# Altium project VolksEEG.PrjPcb
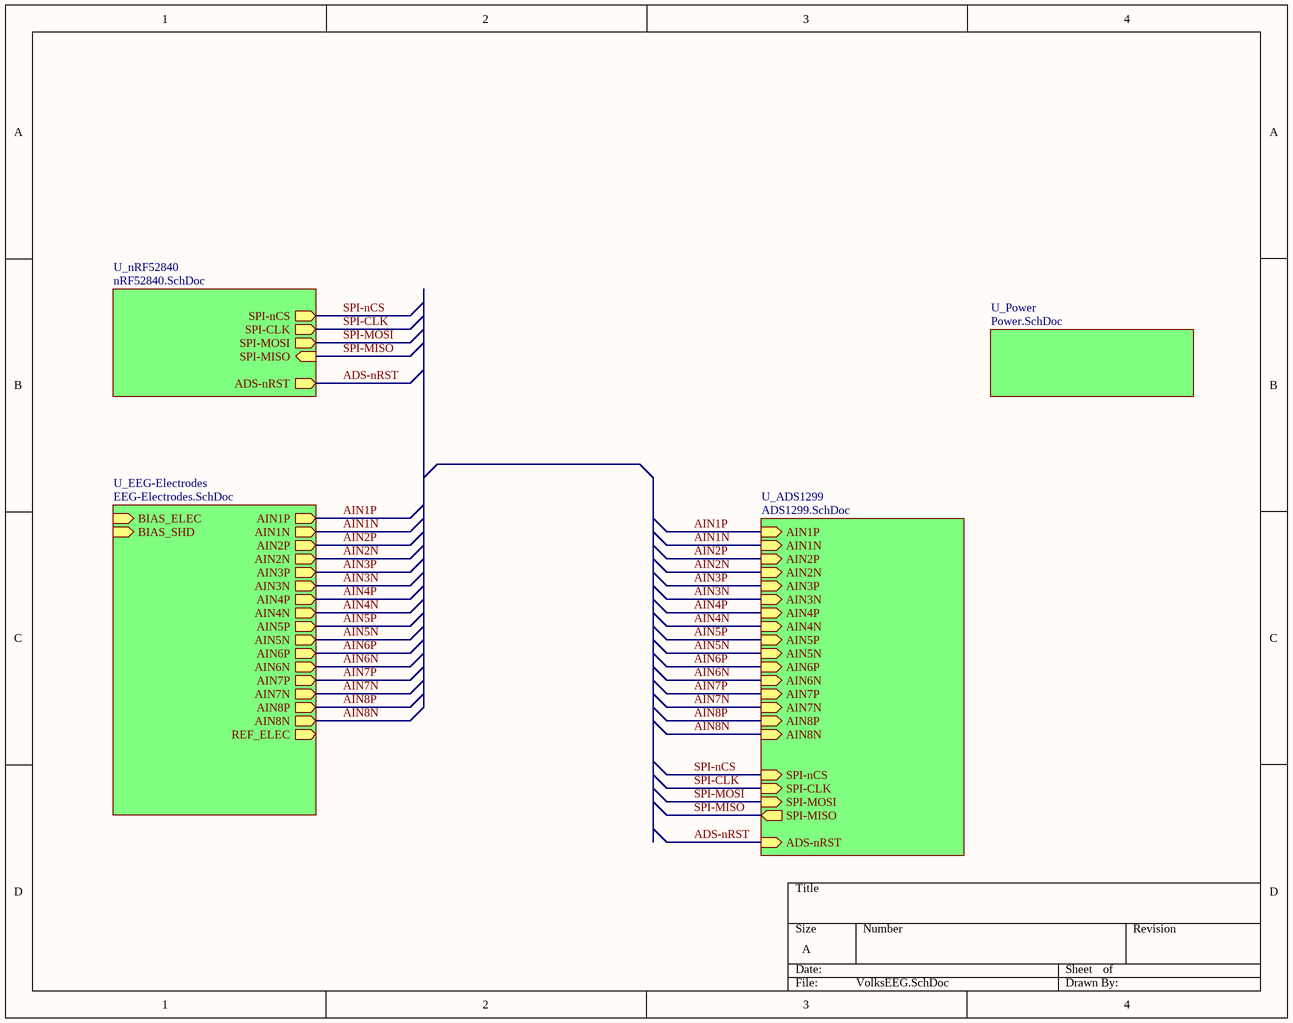
[diagram p0: VolksEEG.SchDoc]
5 sheets, 41 parts. Net scope: hierarchical (ports join the sheet entries above them; power ports are global).
Board file: VolksEEG.PcbDoc
Sheets:
  VolksEEG.SchDoc
    U_nRF52840 = nRF52840.SchDoc
    U_ADS1299 = ADS1299.SchDoc
    U_EEG-Electrodes = EEG-Electrodes.SchDoc
    U_Power = Power.SchDoc

## Sheet VolksEEG.SchDoc
size A; SheetNumber: 1; SheetTotal: 5

### Sub-sheets
U_ADS1299 = ADS1299.SchDoc: AIN1P (in), AIN1N (in), AIN2P (in), AIN2N (in), AIN3P (in), AIN3N (in), AIN4P (in), AIN4N (in), AIN5P (in), AIN5N (in), AIN6P (in), AIN6N (in), AIN7P (in), AIN7N (in), AIN8P (in), AIN8N (in), SPI-MOSI (in), ADS-nRST (in), SPI-MISO (out), SPI-nCS (in), SPI-CLK (in)
U_EEG-Electrodes = EEG-Electrodes.SchDoc: AIN1P (out), AIN1N (out), AIN2P (out), AIN2N (out), AIN3P (out), AIN3N (out), AIN4P (out), AIN4N (out), AIN5P (out), AIN5N (out), AIN6P (out), AIN6N (out), AIN7P (out), AIN7N (out), AIN8P (out), AIN8N (out), REF_ELEC (out), BIAS_ELEC (in), BIAS_SHD (in)
U_nRF52840 = nRF52840.SchDoc: SPI-nCS (out), SPI-MISO (in), SPI-CLK (out), ADS-nRST (out), SPI-MOSI (out)
U_Power = Power.SchDoc: no entries

### Nets
ADS-nRST: sheet U_nRF52840/ADS-nRST, sheet U_ADS1299/ADS-nRST
AIN1N: sheet U_ADS1299/AIN1N, sheet U_EEG-Electrodes/AIN1N
AIN1P: sheet U_ADS1299/AIN1P, sheet U_EEG-Electrodes/AIN1P
AIN2N: sheet U_ADS1299/AIN2N, sheet U_EEG-Electrodes/AIN2N
AIN2P: sheet U_ADS1299/AIN2P, sheet U_EEG-Electrodes/AIN2P
AIN3N: sheet U_ADS1299/AIN3N, sheet U_EEG-Electrodes/AIN3N
AIN3P: sheet U_ADS1299/AIN3P, sheet U_EEG-Electrodes/AIN3P
AIN4N: sheet U_ADS1299/AIN4N, sheet U_EEG-Electrodes/AIN4N
AIN4P: sheet U_ADS1299/AIN4P, sheet U_EEG-Electrodes/AIN4P
AIN5N: sheet U_ADS1299/AIN5N, sheet U_EEG-Electrodes/AIN5N
AIN5P: sheet U_ADS1299/AIN5P, sheet U_EEG-Electrodes/AIN5P
AIN6N: sheet U_ADS1299/AIN6N, sheet U_EEG-Electrodes/AIN6N
AIN6P: sheet U_ADS1299/AIN6P, sheet U_EEG-Electrodes/AIN6P
AIN7N: sheet U_ADS1299/AIN7N, sheet U_EEG-Electrodes/AIN7N
AIN7P: sheet U_ADS1299/AIN7P, sheet U_EEG-Electrodes/AIN7P
AIN8N: sheet U_ADS1299/AIN8N, sheet U_EEG-Electrodes/AIN8N
AIN8P: sheet U_ADS1299/AIN8P, sheet U_EEG-Electrodes/AIN8P
SPI-CLK: sheet U_nRF52840/SPI-CLK, sheet U_ADS1299/SPI-CLK
SPI-MISO: sheet U_nRF52840/SPI-MISO, sheet U_ADS1299/SPI-MISO
SPI-MOSI: sheet U_nRF52840/SPI-MOSI, sheet U_ADS1299/SPI-MOSI
SPI-nCS: sheet U_nRF52840/SPI-nCS, sheet U_ADS1299/SPI-nCS

## Sheet nRF52840.SchDoc
size A4; Organization: Memristor-Robotics; Address1: Vladimira Perića Valtera; Address2: Novi Sad, 21000; Address3: Serbia; SheetNumber: 2; SheetTotal: 5
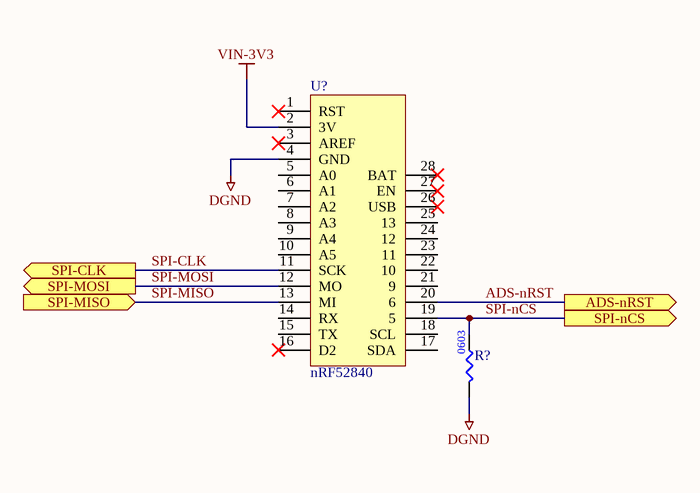
[diagram p1: nRF52840.SchDoc]

### Parts
(Parts that share a designator on the sheet are numbered #1, #2 ... from top to bottom, then left to right.)
R?#1  RES_0603  [RES0603]  (value not drawn)
U?  nRF52840  [nRF52840]

### Ports
ADS-nRST (out), SPI-CLK (out), SPI-MISO (in), SPI-MOSI (out), SPI-nCS (out)

### Nets
DGND: R?#1.1 U?.4(GND)
VIN-3V3: U?.2(3V)
ADS-nRST: U?.20(6) ; port ADS-nRST
SPI-CLK: U?.11(SCK) ; port SPI-CLK
SPI-MISO: U?.13(MI) ; port SPI-MISO
SPI-MOSI: U?.12(MO) ; port SPI-MOSI
SPI-nCS: R?#1.2 U?.19(5) ; port SPI-nCS

Not connected (* = marked no-connect by the designer): U? 1(RST)* 3(AREF)* 5(A0) 6(A1) 7(A2) 8(A3) 9(A4) 10(A5) 14(RX) 15(TX) 16(D2)* 17(SDA) 18(SCL) 21(9) 22(10) 23(11) 24(12) 25(13) 26(USB)* 27(EN)* 28(BAT)*

### Notes on the sheet
- Title
- Date:
- Design Engineer:
- Time:
- Revision:
- Sheet
- of
- Size:
- A4
- www.memristor-robotics.io
- File:
- (in symbol RES_0603) 0603

### Library data of the parts
R?#1 = RES_0603: Generic 0603 resistor
U? = nRF52840: FEATHER NRF52840 SENSE; Manufacturer Part Number: nRF52840; Supplier 1: Mouser; Supplier Part Number 1: 485-4516; Supplier 2: Digi-Key; Supplier Part Number 2: 1528-4516-ND; ComponentLink1Description: Datasheet; ComponentLink1URL: https://cdn-learn.adafruit.com/downloads/pdf/adafruit-feather-sense.pdf

## Sheet ADS1299.SchDoc
size A4; Organization: Memristor-Robotics; Address1: Vladimira Perića Valtera; Address2: Novi Sad, 21000; Address3: Serbia; SheetNumber: 4; SheetTotal: 5
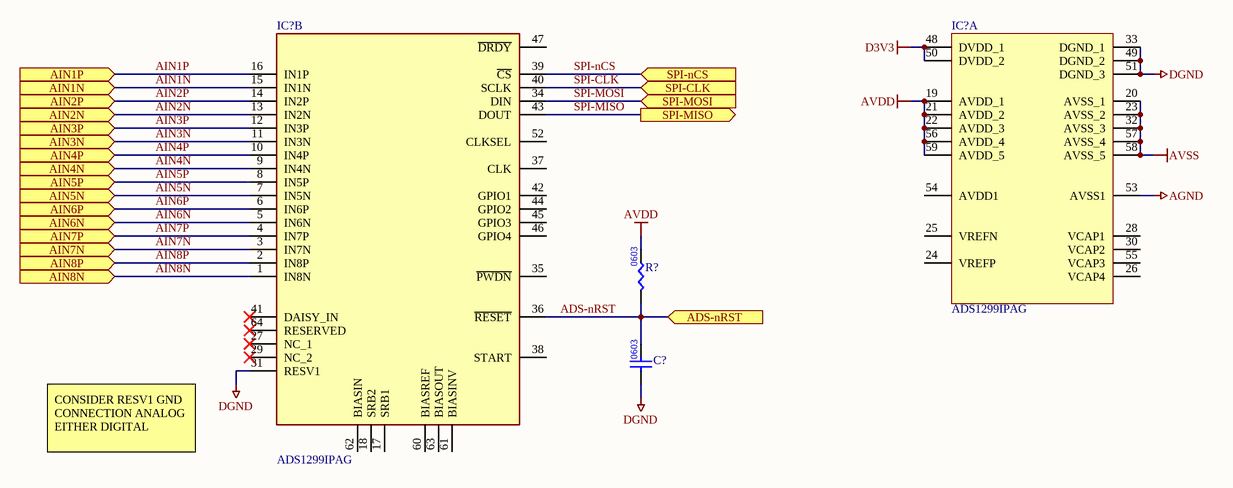
[diagram p2: ADS1299.SchDoc]

### Parts
(Parts that share a designator on the sheet are numbered #1, #2 ... from top to bottom, then left to right.)
C?#1  CAP_0603  [CAP0603]  (value not drawn)
IC?#1  ADS1299IPAG  [QFP50P1200X1200X120-64N]  (part B of 2)
IC?#2  ADS1299IPAG  [QFP50P1200X1200X120-64N]  (part A of 2)
R?#2  RES_0603  [RES0603]  (value not drawn)

### Ports
ADS-nRST (in), AIN1N (in), AIN1P (in), AIN2N (in), AIN2P (in), AIN3N (in), AIN3P (in), AIN4N (in), AIN4P (in), AIN5N (in), AIN5P (in), AIN6N (in), AIN6P (in), AIN7N (in), AIN7P (in), AIN8N (in), AIN8P (in), SPI-CLK (in), SPI-MISO (out), SPI-MOSI (in), SPI-nCS (in)

### Nets
AGND: IC?#2.53(AVSS1)
AVDD: IC?#2.19(AVDD_1) IC?#2.21(AVDD_2) IC?#2.22(AVDD_3) IC?#2.56(AVDD_4) IC?#2.59(AVDD_5) R?#2.2
AVSS: IC?#2.20(AVSS_1) IC?#2.23(AVSS_2) IC?#2.32(AVSS_3) IC?#2.57(AVSS_4) IC?#2.58(AVSS_5)
D3V3: IC?#2.48(DVDD_1) IC?#2.50(DVDD_2)
DGND: C?#1.1 IC?#1.31(RESV1) IC?#2.33(DGND_1) IC?#2.49(DGND_2) IC?#2.51(DGND_3)
ADS-nRST: C?#1.2 IC?#1.36(~{RESET}) R?#2.1 ; port ADS-nRST
AIN1N: IC?#1.15(IN1N) ; port AIN1N
AIN1P: IC?#1.16(IN1P) ; port AIN1P
AIN2N: IC?#1.13(IN2N) ; port AIN2N
AIN2P: IC?#1.14(IN2P) ; port AIN2P
AIN3N: IC?#1.11(IN3N) ; port AIN3N
AIN3P: IC?#1.12(IN3P) ; port AIN3P
AIN4N: IC?#1.9(IN4N) ; port AIN4N
AIN4P: IC?#1.10(IN4P) ; port AIN4P
AIN5N: IC?#1.7(IN5N) ; port AIN5N
AIN5P: IC?#1.8(IN5P) ; port AIN5P
AIN6N: IC?#1.5(IN6N) ; port AIN6N
AIN6P: IC?#1.6(IN6P) ; port AIN6P
AIN7N: IC?#1.3(IN7N) ; port AIN7N
AIN7P: IC?#1.4(IN7P) ; port AIN7P
AIN8N: IC?#1.1(IN8N) ; port AIN8N
AIN8P: IC?#1.2(IN8P) ; port AIN8P
SPI-CLK: IC?#1.40(SCLK) ; port SPI-CLK
SPI-MISO: IC?#1.43(DOUT) ; port SPI-MISO
SPI-MOSI: IC?#1.34(DIN) ; port SPI-MOSI
SPI-nCS: IC?#1.39(~{CS}) ; port SPI-nCS

Not connected (* = marked no-connect by the designer): IC?#1 17(SRB1) 18(SRB2) 27(NC_1)* 29(NC_2)* 35(~{PWDN}) 37(CLK) 38(START) 41(DAISY_IN)* 42(GPIO1) 44(GPIO2) 45(GPIO3) 46(GPIO4) 47(~{DRDY}) 52(CLKSEL) 60(BIASREF) 61(BIASINV) 62(BIASIN) 63(BIASOUT) 64(RESERVED)*; IC?#2 24(VREFP) 25(VREFN) 26(VCAP4) 28(VCAP1) 30(VCAP2) 54(AVDD1) 55(VCAP3)

### Notes on the sheet
- CONSIDER RESV1 GND CONNECTION ANALOG EITHER DIGITAL
- Title
- Date:
- Design Engineer:
- Time:
- Revision:
- Sheet
- of
- Size:
- A4
- www.memristor-robotics.io
- File:
- (in symbol RES_0603) 0603

### Library data of the parts
C?#1 = CAP_0603: Generic 0603 cap; Manufacturer 1: *; Manufacturer Part Number 1: *; Supplier 1: *; Supplier Part Number 1: *; Value: *; Voltage Rating: *; Package: 0603; Mounting Type: Surface Mount
IC?#1 IC?#2 = ADS1299: Integrated Circuit; Manufacturer: Texas Instruments; Height: 1.2mm; Manufacturer Part Number: ADS1299IPAG; ComponentLink1Description: Datasheet; ComponentLink1URL: http://www.ti.com/lit/ds/symlink/ads1299.pdf; Supplier 1: Mouser; Supplier Part Number 1: 595-ADS1299IPAGR
R?#2 = RES_0603: Generic 0603 resistor

## Sheet EEG-Electrodes.SchDoc
size A4; Organization: Memristor-Robotics; Address1: Vladimira Perića Valtera; Address2: Novi Sad, 21000; Address3: Serbia; SheetNumber: 5; SheetTotal: 5
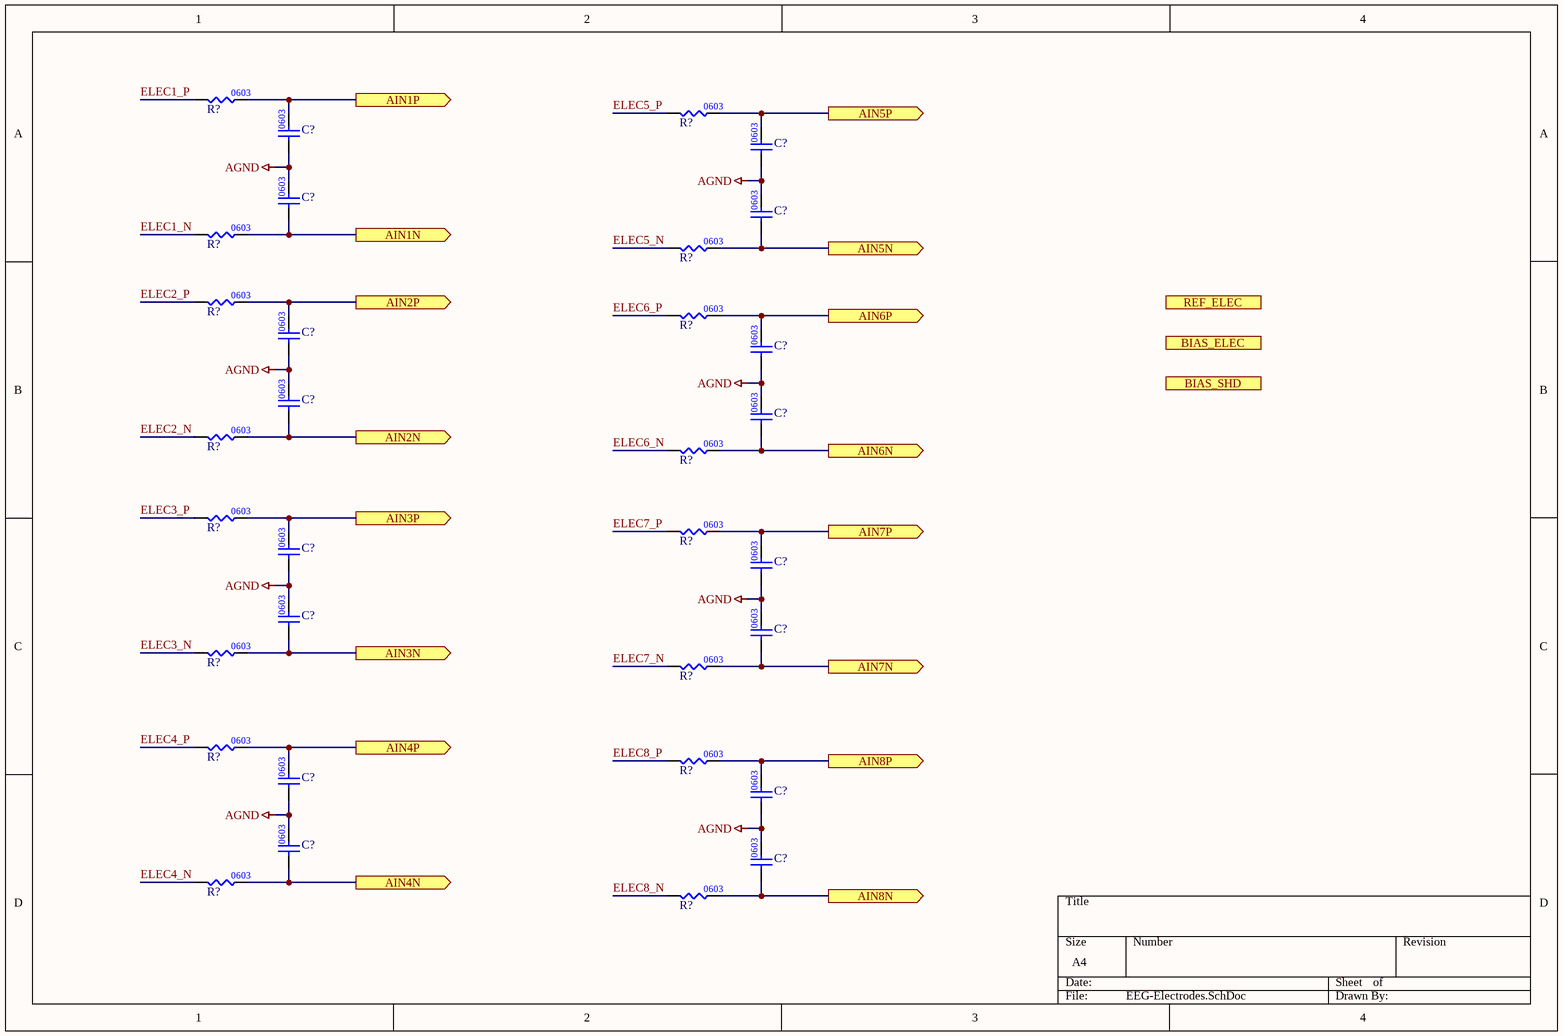
[diagram p3: EEG-Electrodes.SchDoc]

### Parts
(Parts that share a designator on the sheet are numbered #1, #2 ... from top to bottom, then left to right.)
C?#2  CAP_0603  [CAP0603]  (value not drawn)
C?#3  CAP_0603  [CAP0603]  (value not drawn)
C?#4  CAP_0603  [CAP0603]  (value not drawn)
C?#5  CAP_0603  [CAP0603]  (value not drawn)
C?#6  CAP_0603  [CAP0603]  (value not drawn)
C?#7  CAP_0603  [CAP0603]  (value not drawn)
C?#8  CAP_0603  [CAP0603]  (value not drawn)
C?#9  CAP_0603  [CAP0603]  (value not drawn)
C?#10  CAP_0603  [CAP0603]  (value not drawn)
C?#11  CAP_0603  [CAP0603]  (value not drawn)
C?#12  CAP_0603  [CAP0603]  (value not drawn)
C?#13  CAP_0603  [CAP0603]  (value not drawn)
C?#14  CAP_0603  [CAP0603]  (value not drawn)
C?#15  CAP_0603  [CAP0603]  (value not drawn)
C?#16  CAP_0603  [CAP0603]  (value not drawn)
C?#17  CAP_0603  [CAP0603]  (value not drawn)
R?#3  RES_0603  [RES0603]  (value not drawn)
R?#4  RES_0603  [RES0603]  (value not drawn)
R?#5  RES_0603  [RES0603]  (value not drawn)
R?#6  RES_0603  [RES0603]  (value not drawn)
R?#7  RES_0603  [RES0603]  (value not drawn)
R?#8  RES_0603  [RES0603]  (value not drawn)
R?#9  RES_0603  [RES0603]  (value not drawn)
R?#10  RES_0603  [RES0603]  (value not drawn)
R?#11  RES_0603  [RES0603]  (value not drawn)
R?#12  RES_0603  [RES0603]  (value not drawn)
R?#13  RES_0603  [RES0603]  (value not drawn)
R?#14  RES_0603  [RES0603]  (value not drawn)
R?#15  RES_0603  [RES0603]  (value not drawn)
R?#16  RES_0603  [RES0603]  (value not drawn)
R?#17  RES_0603  [RES0603]  (value not drawn)
R?#18  RES_0603  [RES0603]  (value not drawn)

### Ports
AIN1N (out), AIN1P (out), AIN2N (out), AIN2P (out), AIN3N (out), AIN3P (out), AIN4N (out), AIN4P (out), AIN5N (out), AIN5P (out), AIN6N (out), AIN6P (out), AIN7N (out), AIN7P (out), AIN8N (out), AIN8P (out), BIAS_ELEC (in), BIAS_SHD (in), REF_ELEC (out)

### Nets
AGND: C?#2.1 C?#3.1 C?#4.2 C?#5.2 C?#6.1 C?#7.1 C?#8.2 C?#9.2 C?#10.1 C?#11.1 C?#12.2 C?#13.2 C?#14.1 C?#15.1 C?#16.2 C?#17.2
AIN1N: C?#4.1 R?#5.2 ; port AIN1N
AIN1P: C?#2.2 R?#3.2 ; port AIN1P
AIN2N: C?#8.1 R?#9.2 ; port AIN2N
AIN2P: C?#6.2 R?#7.2 ; port AIN2P
AIN3N: C?#12.1 R?#13.2 ; port AIN3N
AIN3P: C?#10.2 R?#11.2 ; port AIN3P
AIN4N: C?#16.1 R?#17.2 ; port AIN4N
AIN4P: C?#14.2 R?#15.2 ; port AIN4P
AIN5N: C?#5.1 R?#6.2 ; port AIN5N
AIN5P: C?#3.2 R?#4.2 ; port AIN5P
AIN6N: C?#9.1 R?#10.2 ; port AIN6N
AIN6P: C?#7.2 R?#8.2 ; port AIN6P
AIN7N: C?#13.1 R?#14.2 ; port AIN7N
AIN7P: C?#11.2 R?#12.2 ; port AIN7P
AIN8N: C?#17.1 R?#18.2 ; port AIN8N
AIN8P: C?#15.2 R?#16.2 ; port AIN8P
ELEC1_N: R?#5.1
ELEC1_P: R?#3.1
ELEC2_N: R?#9.1
ELEC2_P: R?#7.1
ELEC3_N: R?#13.1
ELEC3_P: R?#11.1
ELEC4_N: R?#17.1
ELEC4_P: R?#15.1
ELEC5_N: R?#6.1
ELEC5_P: R?#4.1
ELEC6_N: R?#10.1
ELEC6_P: R?#8.1
ELEC7_N: R?#14.1
ELEC7_P: R?#12.1
ELEC8_N: R?#18.1
ELEC8_P: R?#16.1

### Notes on the sheet
- Title
- Date:
- Design Engineer:
- Time:
- Revision:
- Sheet
- of
- Size:
- A4
- www.memristor-robotics.io
- File:
- (in symbol RES_0603) 0603

### Library data of the parts
C?#2-C?#17 = CAP_0603: Generic 0603 cap; Manufacturer 1: *; Manufacturer Part Number 1: *; Supplier 1: *; Supplier Part Number 1: *; Value: *; Voltage Rating: *; Package: 0603; Mounting Type: Surface Mount
R?#3-R?#18 = RES_0603: Generic 0603 resistor

## Sheet Power.SchDoc
size A4; Organization: Memristor-Robotics; Address1: Vladimira Perića Valtera; Address2: Novi Sad, 21000; Address3: Serbia; SheetNumber: 3; SheetTotal: 5
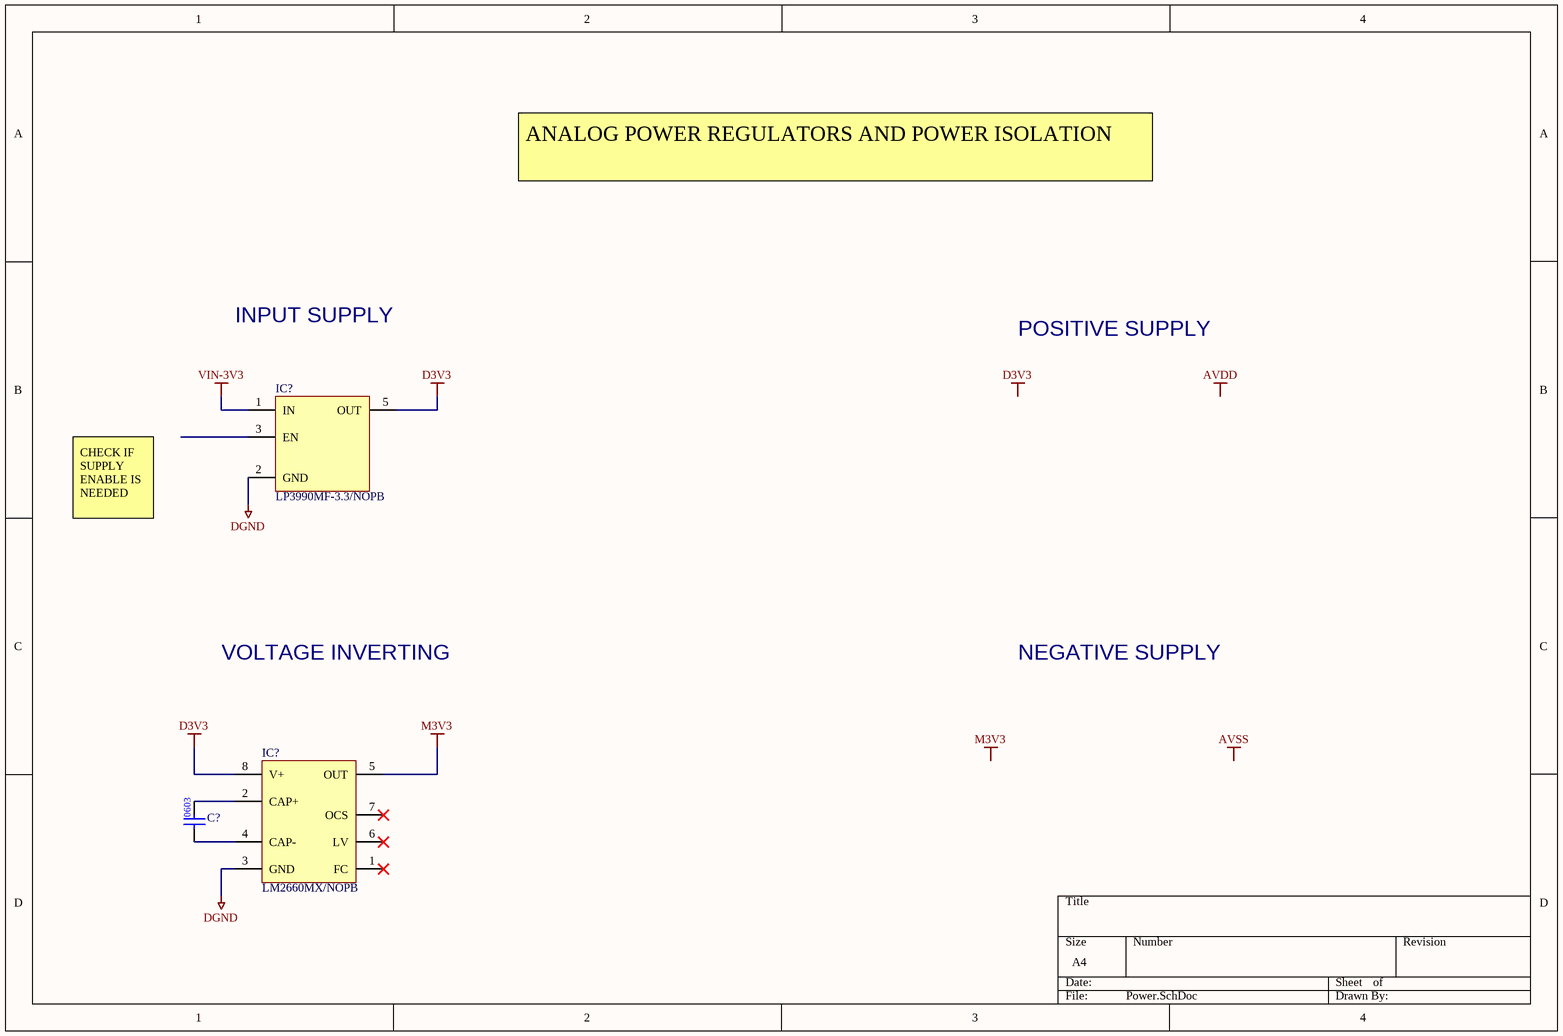
[diagram p4: Power.SchDoc]

### Parts
(Parts that share a designator on the sheet are numbered #1, #2 ... from top to bottom, then left to right.)
C?#18  CAP_0603  [CAP0603]  (value not drawn)
IC?#3  LP3990MF-3.3/NOPB  [SOT95P280X145-5N]
IC?#4  LM2660MX/NOPB  [SOIC127P599X175-8N]

### Nets
D3V3: IC?#3.5(OUT) IC?#4.8(V+)
DGND: IC?#3.2(GND) IC?#4.3(GND)
M3V3: IC?#4.5(OUT)
VIN-3V3: IC?#3.1(IN)
NetC?#18_1: C?#18.1 IC?#4.4(CAP-)
NetC?#18_2: C?#18.2 IC?#4.2(CAP+)

Not connected (* = marked no-connect by the designer): IC?#3 3(EN); IC?#4 1(FC)* 6(LV)* 7(OCS)*

### Notes on the sheet
- ANALOG POWER REGULATORS AND POWER ISOLATION
- INPUT SUPPLY
- POSITIVE SUPPLY
- CHECK IF SUPPLY ENABLE IS NEEDED
- VOLTAGE INVERTING
- NEGATIVE SUPPLY
- Labels drawn without touching a wire or pin: AVDD, AVSS, D3V3, M3V3
- Title
- Date:
- Design Engineer:
- Time:
- Revision:
- Sheet
- of
- Size:
- A4
- www.memristor-robotics.io
- File:

### Library data of the parts
C?#18 = CAP_0603: Generic 0603 cap; Manufacturer 1: *; Manufacturer Part Number 1: *; Supplier 1: *; Supplier Part Number 1: *; Value: *; Voltage Rating: *; Package: 0603; Mounting Type: Surface Mount
IC?#3 = LP3990MF: IC REG LINEAR 3.3V 150MA SOT23-5; Manufacturer: Texas Instruments; Input Voltage: 6V; Manufacturer Part Number: LP3990MF-3.3/NOPB; Output Current: 150mA; Topology: Linear; ComponentLink1Description: Datasheet; ComponentLink1URL: https://www.ti.com/lit/ds/symlink/lp3990.pdf?ts=1633191563532; Output Voltage: 3.3V; Supplier 1: Mouser; Supplier Part Number 1: 926-LP3990MF-3.3NOPB; Supplier 2: Digi-Key; Supplier Part Number 2: LP3990MF-3.3/NOPBCT-ND
IC?#4 = LM2660MX: IC REG CHARGE PUMP INV 8SOIC; Manufacturer: Texas Instruments; Input Voltage: 1.5V - 5.5V; Output Current: 100mA; Manufacturer Part Number: LM2660MX/NOPB; Topology: Charge Pump; Supplier 1: Mouser; Supplier Part Number 1: 926-LM2660MX/NOPB; Supplier 2: Digi-Key; Supplier Part Number 2: LM2660MX/NOPBCT-ND; Supplier 3: LCSC; Supplier Part Number 3: C183083; ComponentLink1Description: Datasheet; ComponentLink1URL: https://www.ti.com/lit/ds/symlink/lm2660.pdf?HQS=dis-mous-null-mousermode-dsf-pf-null-wwe&ts=1633188209511&ref_url=https%253A%252F%252Feu.mouser.com%252F

## Nets that join several sheets
AGND: ADS1299 (IC?#2.53), EEG-Electrodes (16 pins)
D3V3: ADS1299 (IC?#2.48 IC?#2.50), Power (IC?#3.5 IC?#4.8)
DGND: nRF52840 (R?#1.1 U?.4), ADS1299 (5 pins), Power (IC?#3.2 IC?#4.3)
VIN-3V3: nRF52840 (U?.2), Power (IC?#3.1)
ADS-nRST: nRF52840 (U?.20), ADS1299 (C?#1.2 IC?#1.36 R?#2.1)
AIN1N: ADS1299 (IC?#1.15), EEG-Electrodes (C?#4.1 R?#5.2)
AIN1P: ADS1299 (IC?#1.16), EEG-Electrodes (C?#2.2 R?#3.2)
AIN2N: ADS1299 (IC?#1.13), EEG-Electrodes (C?#8.1 R?#9.2)
AIN2P: ADS1299 (IC?#1.14), EEG-Electrodes (C?#6.2 R?#7.2)
AIN3N: ADS1299 (IC?#1.11), EEG-Electrodes (C?#12.1 R?#13.2)
AIN3P: ADS1299 (IC?#1.12), EEG-Electrodes (C?#10.2 R?#11.2)
AIN4N: ADS1299 (IC?#1.9), EEG-Electrodes (C?#16.1 R?#17.2)
AIN4P: ADS1299 (IC?#1.10), EEG-Electrodes (C?#14.2 R?#15.2)
AIN5N: ADS1299 (IC?#1.7), EEG-Electrodes (C?#5.1 R?#6.2)
AIN5P: ADS1299 (IC?#1.8), EEG-Electrodes (C?#3.2 R?#4.2)
AIN6N: ADS1299 (IC?#1.5), EEG-Electrodes (C?#9.1 R?#10.2)
AIN6P: ADS1299 (IC?#1.6), EEG-Electrodes (C?#7.2 R?#8.2)
AIN7N: ADS1299 (IC?#1.3), EEG-Electrodes (C?#13.1 R?#14.2)
AIN7P: ADS1299 (IC?#1.4), EEG-Electrodes (C?#11.2 R?#12.2)
AIN8N: ADS1299 (IC?#1.1), EEG-Electrodes (C?#17.1 R?#18.2)
AIN8P: ADS1299 (IC?#1.2), EEG-Electrodes (C?#15.2 R?#16.2)
SPI-CLK: nRF52840 (U?.11), ADS1299 (IC?#1.40)
SPI-MISO: nRF52840 (U?.13), ADS1299 (IC?#1.43)
SPI-MOSI: nRF52840 (U?.12), ADS1299 (IC?#1.34)
SPI-nCS: nRF52840 (R?#1.2 U?.19), ADS1299 (IC?#1.39)